# Altium schematic sheet Top.SchDoc
size A4
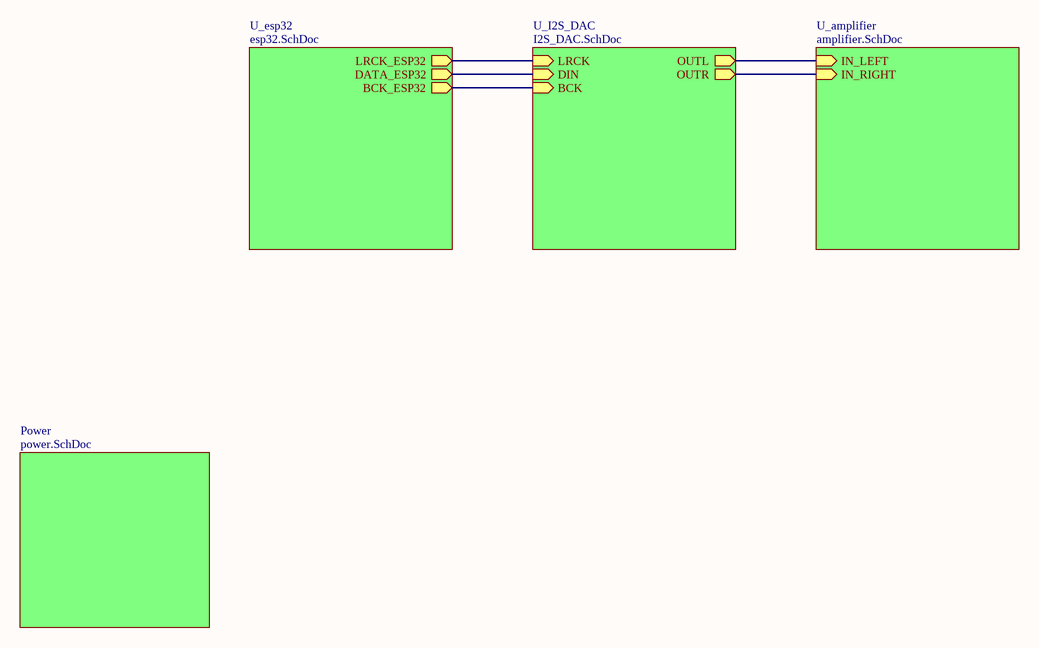
[diagram p0: Top.SchDoc]

## Sub-sheets
Power = power.SchDoc: no entries
U_amplifier = amplifier.SchDoc: IN_LEFT (in), IN_RIGHT (in)
U_esp32 = esp32.SchDoc: LRCK_ESP32 (out), DATA_ESP32 (out), BCK_ESP32 (out)
U_I2S_DAC = I2S_DAC.SchDoc: DIN (in), BCK (in), LRCK (in), OUTR (out), OUTL (out)

## Nets
(unnamed): sheet U_esp32/LRCK_ESP32, sheet U_I2S_DAC/LRCK
(unnamed): sheet U_esp32/DATA_ESP32, sheet U_I2S_DAC/DIN
(unnamed): sheet U_esp32/BCK_ESP32, sheet U_I2S_DAC/BCK
(unnamed): sheet U_I2S_DAC/OUTR, sheet U_amplifier/IN_RIGHT
(unnamed): sheet U_I2S_DAC/OUTL, sheet U_amplifier/IN_LEFT